# EasyEDA Pro project ProPrj_MiniFoc_AT32F435.epro, schematic 功率板
Create Date: 2023-12-07; Page Name: 电源和功率层; Project Name: Mini_ODrive_AT32F435 FOC驱动器; Schematic Name: Schematic2; Update Date: 2024-02-11; Company: 嘉立创EDA; Page Size: A4; Version: V1.0
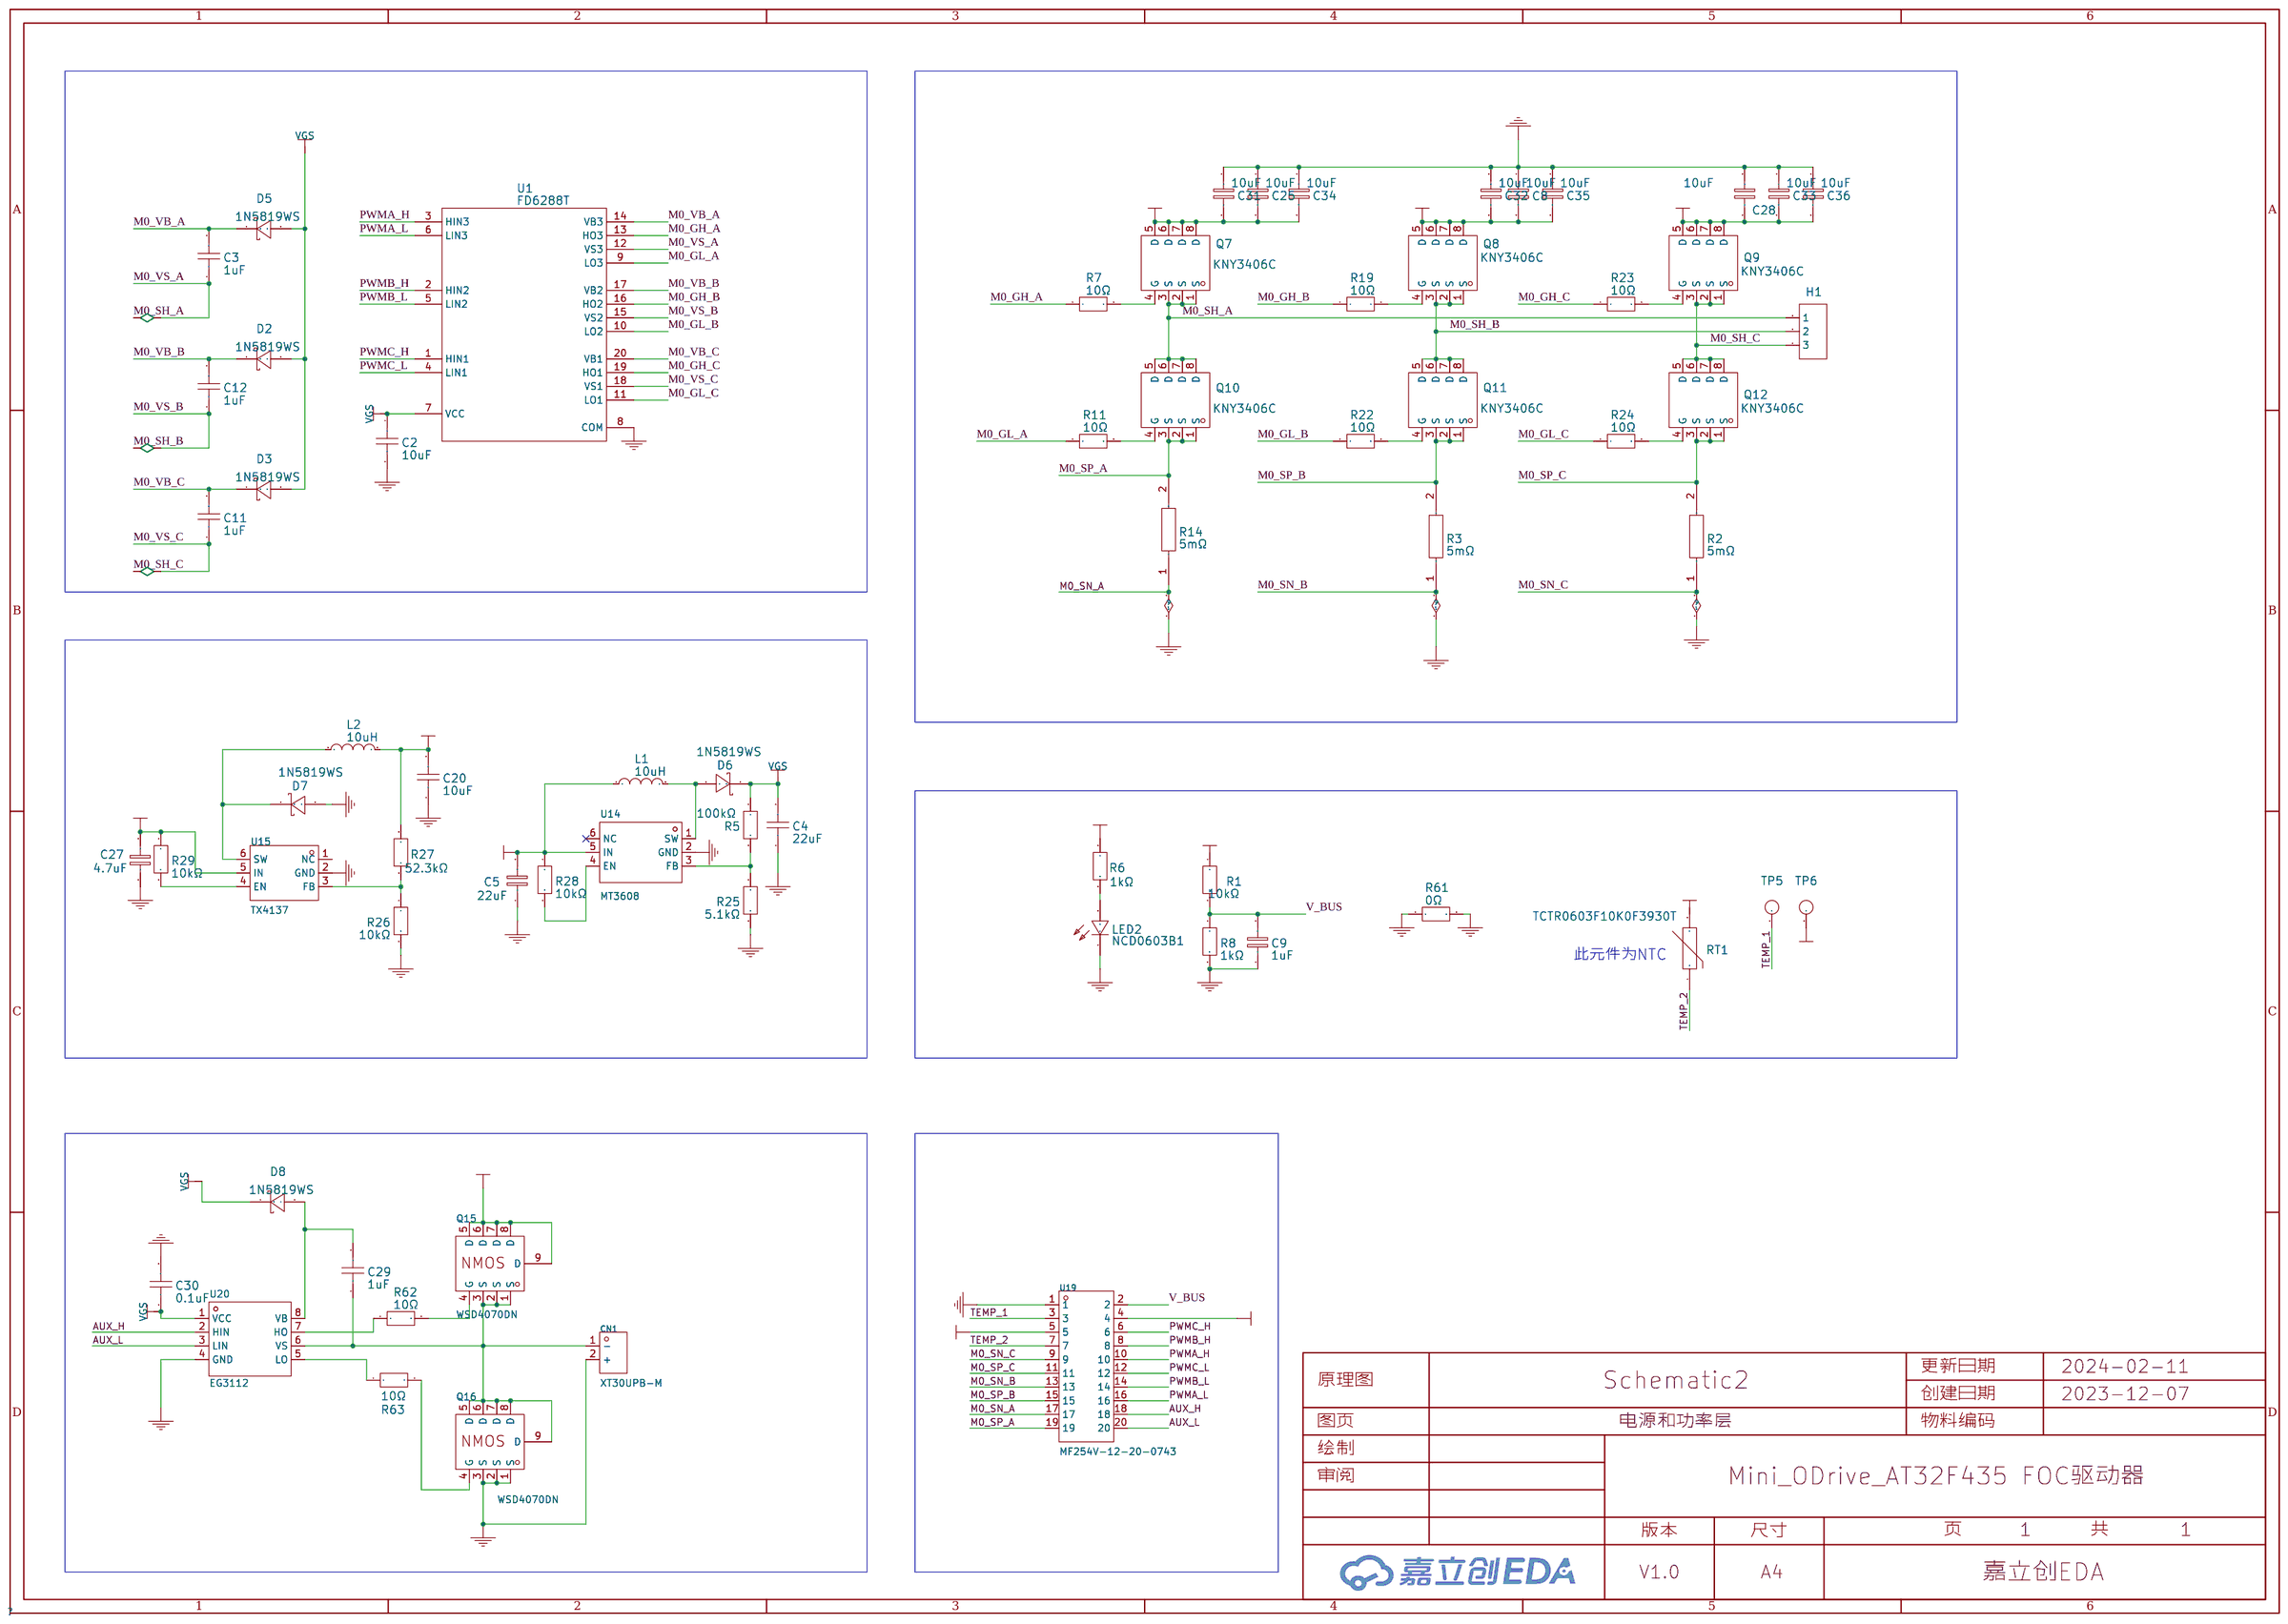
[diagram p1: schematic sheet]

## Parts
C2  10uF  [C0603_SMALL]
C3  1uF  [C0603_SMALL]
C4  22uF  [C1206_SMALL]
C5  22uF  [C1206_SMALL]
C8  10uF  [C1206_SMALL]
C9  1uF  [C0603_SMALL]
C11  1uF  [C0603_SMALL]
C12  1uF  [C0603_SMALL]
C20  10uF  [C1206_SMALL]
C25  10uF  [C1206_SMALL]
C27  4.7uF  [C1206_SMALL]
C28  10uF  [C1206_SMALL]
C29  1uF  [C0603_SMALL]
C30  0.1uF  [C0603_SMALL]
C31  10uF  [C1206_SMALL]
C32  10uF  [C1206_SMALL]
C33  10uF  [C1206_SMALL]
C34  10uF  [C1206_SMALL]
C35  10uF  [C1206_SMALL]
C36  10uF  [C1206_SMALL]
CN1  XT30UPB-M  [CONN-TH_XT30UPB-M]
D2  1N5819WS  [SOD-323_L1.8-W1.3-LS2.5-RD]
D3  1N5819WS  [SOD-323_L1.8-W1.3-LS2.5-RD]
D5  1N5819WS  [SOD-323_L1.8-W1.3-LS2.5-RD]
D6  1N5819WS  [SOD-323_L1.8-W1.3-LS2.5-RD]
D7  1N5819WS  [SOD-323_L1.8-W1.3-LS2.5-RD]
D8  1N5819WS  [SOD-323_L1.8-W1.3-LS2.5-RD]
H1  MR30-M  [MR30-M]
L1  10uH  [IND-SMD_L2.5-W2.0]
L2  10uH  [IND-SMD_L2.5-W2.0]
LED2  NCD0603B1  [LED0603_RED_SMALL]
Q7  KNY3406C  [PDFNWB-8L_L6.0-W5.0-P1.27-BL-EP_CON]
Q8  KNY3406C  [PDFNWB-8L_L6.0-W5.0-P1.27-BL-EP_CON]
Q9  KNY3406C  [PDFNWB-8L_L6.0-W5.0-P1.27-BL-EP_CON]
Q10  KNY3406C  [PDFNWB-8L_L6.0-W5.0-P1.27-BL-EP_CON]
Q11  KNY3406C  [PDFNWB-8L_L6.0-W5.0-P1.27-BL-EP_CON]
Q12  KNY3406C  [PDFNWB-8L_L6.0-W5.0-P1.27-BL-EP_CON]
Q15  WSD4070DN  [PDFN3333-8_L3.1-W3.2-P0.65-LS3.4-BL]
Q16  WSD4070DN  [PDFN3333-8_L3.1-W3.2-P0.65-LS3.4-BL]
R1  10kΩ  [R0603_SMALL]
R2  5mΩ  [R2512]
R3  5mΩ  [R2512]
R5  100kΩ  [R0603_SMALL]
R6  1kΩ  [R0603_SMALL]
R7  10Ω  [R0603_SMALL]
R8  1kΩ  [R0603_SMALL]
R11  10Ω  [R0603_SMALL]
R14  5mΩ  [R2512]
R19  10Ω  [R0603_SMALL]
R22  10Ω  [R0603_SMALL]
R23  10Ω  [R0603_SMALL]
R24  10Ω  [R0603_SMALL]
R25  5.1kΩ  [R0603_SMALL]
R26  10kΩ  [R0603_SMALL]
R27  52.3kΩ  [R0603_SMALL]
R28  10kΩ  [R0603_SMALL]
R29  10kΩ  [R0603_SMALL]
R61  0Ω  [R0603_SMALL]
R62  10Ω  [R0603_SMALL]
R63  10Ω  [R0603_SMALL]
RT1  TCTR0603F10K0F3930T  [R0603_SMALL]
TP5  Testpoint 1.6mm  [TESTPOINT 1.6MM]  (no BOM)
TP6  Testpoint 1.6mm  [TESTPOINT 1.6MM]  (no BOM)
U1  FD6288T  [TSSOP-20_L6.5-W4.4-P0.65-LS6.4-BL]
U14  MT3608  [SOT-23-6_L2.9-W1.6-P0.95-LS2.8-BR]
U15  TX4137  [SOT-23-6_L2.9-W1.6-P0.95-LS2.8-BL]
U19  MF254V-12-20-0743  [HDR-TH_20P-P2.54-V-F-R2-C10-S2.54-3]
U20  EG3112  [SOIC-8_L4.9-W3.9-P1.27-LS6.0-BL]

## Library data of the parts
C2 = GRM188R6YA106MA73D: 容值:10uF;精度:±20%;额定电压:35V;材质(温度系数):-;; LCSC Part Name: 10uF ±20% 35V; Supplier Part: C194427; Manufacturer: muRata(村田); Supplier Footprint: 0603; JLCPCB Part Class: Extended Part; Datasheet: https://atta.szlcsc.com/upload/public/pdf/source/20210128/C194427_FCA3640823207DDB58700A82F1A19B5F.pdf; Supplier: LCSC; Tolerance: ±20%; Voltage Rated: 35V; Check: true
C3 C9 C11 C12 C29 C30 = CC0603KRX5R8BB105: 容值:1uF;精度:±10%;额定电压:25V;材质(温度系数):X5R;; LCSC Part Name: 1uF ±10% 25V; Supplier Part: C14664; Manufacturer: YAGEO(国巨); Supplier Footprint: 0603; JLCPCB Part Class: Extended Part; Datasheet: https://atta.szlcsc.com/upload/public/pdf/source/20160606/1465200209684.pdf; Supplier: LCSC; Tolerance: ±10%; Voltage Rated: 25V; Temperature Coefficient: X5R; Check: true
C4 C20 = C1206B476M016T: 容值:47uF;精度:±20%;额定电压:16V;材质(温度系数):-;; LCSC Part Name: 47uF ±20% 16V; Supplier Part: C607993; Manufacturer: IHHEC(禾伸堂); Supplier Footprint: 1206; JLCPCB Part Class: Extended Part; Datasheet: https://atta.szlcsc.com/upload/public/pdf/source/20190313/C374174_331C86E4A68CC9C732DA87186AAF7F8A.pdf; Supplier: LCSC; Tolerance: ±20%; Voltage Rated: 16V; Check: true
C5 C27 = CC1206KKX7R9BB475: 容值:4.7uF;精度:±10%;额定电压:50V;材质(温度系数):X7R;; LCSC Part Name: 4.7uF ±10% 50V; Supplier Part: C132170; Manufacturer: YAGEO(国巨); Supplier Footprint: 1206; JLCPCB Part Class: Extended Part; Datasheet: https://atta.szlcsc.com/upload/public/pdf/source/20170925/C132170_1506321669570990451.pdf; Supplier: LCSC; Tolerance: ±10%; Voltage Rated: 50V; Temperature Coefficient: X7R; Check: true
C8 C25 C28 C31-C36 = C1206X7R106K500NT: 容值:10uF;精度:±10%;额定电压:50V;材质(温度系数):-;; LCSC Part Name: 10uF ±10% 50V; Supplier Part: C729470; Manufacturer: SANYEAR(叁叶源); Supplier Footprint: 1206; JLCPCB Part Class: Extended Part; Datasheet: https://atta.szlcsc.com/upload/public/pdf/source/20200102/C475251_1E30ECAC0E8AE7254982658A02A2D78C.pdf; Supplier: LCSC; Tolerance: ±10%; Voltage Rated: 50V; Check: true
CN1 = XT30UPB-M: 类别:-;类型1:-;; LCSC Part Name: AMASS(艾迈斯)板载立式 航模锂电池控制器连接器插头 公头XT30UPB-M; Supplier Part: C428721; Manufacturer: AMASS(艾迈斯); JLCPCB Part Class: Extended Part; Datasheet: https://atta.szlcsc.com/upload/public/pdf/source/20230412/7B5DFEF57C9EA5273853390C734B3AC5.pdf; Supplier: LCSC; Brand: 艾迈斯; Type: 航模插头; Colour: 黄色; RatedVoltage: DC 500V; InterfaceType: 公头; MetalMaterial: 镀金; InsulationMaterial: PA; RatedCurrent: 15A; contact resistance: 0.65mΩ
D2 D3 D5-D8 = 1N5819WS_C191023: 直流反向耐压(Vr):40V;平均整流电流(Io):1A;正向压降(Vf):600mV@1A;; LCSC Part Name: 40V 1A 600mV@1A; Supplier Part: C191023; Manufacturer: Hottech(合科泰); Supplier Footprint: SOD-323; JLCPCB Part Class: Basic Part; Datasheet: https://atta.szlcsc.com/upload/public/pdf/source/20220428/3CB86FD8D28D653594B4E35F9D5AEFD9.pdf; Supplier: LCSC; Reverse Voltage (Vr): 40V; Average Rectified Current (Io): 1A; Forward Voltage (Vf@If): 600mV@1A
H1 = MR30-M: Supplier Part: C146690; Supplier: LCSC; Check: true
L1 L2 = SWPA252012S4R7MT: 电感值:4.7uH;精度:±20%;额定电流:840mA;直流电阻(DCR):377mΩ;; LCSC Part Name: 4.7uH ±20% 840mA 377mΩ; Supplier Part: C87640; Manufacturer: Sunlord(顺络); Supplier Footprint: SMD; JLCPCB Part Class: Extended Part; Datasheet: https://atta.szlcsc.com/upload/public/pdf/source/20210916/AC798BA7E846B7D0B6818F45CD84DB0B.pdf; Supplier: LCSC; Tolerance: ±20%; Rated Current: 840mA; DC Resistance (DCR): 377mΩ
LED2 = NCD0603B1: 发光颜色:蓝灯;; LCSC Part Name: 蓝灯; Supplier Part: C84266; Manufacturer: 国星光电; Supplier Footprint: 0603; JLCPCB Part Class: Extended Part; Datasheet: https://atta.szlcsc.com/upload/public/pdf/source/20200820/C84266_6A3CDBEFA72C6CAD68EDA53474ADAE6C.pdf; Supplier: LCSC; Emitted Color: 蓝灯
Q7-Q12 = CJAC100SN08: Supplier: LCSC; Supplier Part: C504077; Manufacturer: CJ; JLCPCB Part Class: Extended Part; Check: true
Q15 Q16 = WSD4070DN: 类型:N沟道;漏源电压(Vdss):40V;连续漏极电流(Id):68A;功率(Pd):3.1W;导通电阻(RDS(on)@Vgs,Id):4.5mΩ@10V,7A;阈值电压(Vgs(th)@Id):1.9V@250uA;; LCSC Part Name: N沟道 耐压:40V 电流:68A; Supplier Part: C719095; Manufacturer: WINSOK(微硕); Supplier Footprint: PDFN3333-8; JLCPCB Part Class: Extended Part; Datasheet: https://atta.szlcsc.com/upload/public/pdf/source/20200812/C719095_C62CD761C2D97EC4C1BD580B00C6E003.pdf; Supplier: LCSC; Type: N沟道; Drain Source Voltage (Vdss): 40V; Continuous Drain Current (Id): 68A; Power Dissipation (Pd): 3.1W; Drain Source On Resistance (RDS(on)@Vgs,Id): 4.5mΩ@10V,7A; Gate Threshold Voltage (Vgs(th)@Id): 1.9V@250uA; Total Gate Charge (Qg@Vgs): 28nC@10V; Input Capacitance (Ciss@Vds): 2.82nF@20V; Reverse Transfer Capacitance (Crss@Vds): 150pF@20V; Operating Temperature: -55℃~+150℃@(Tj)
R1 R25 R26 R28 R29 = CR0603JA0103G: 电阻类型:厚膜电阻;阻值:10kΩ;精度:±5%;功率:100mW;温度系数:±200ppm/℃;最大工作电压:50V;工作温度范围:-55℃~+125℃;; LCSC Part Name: 10kΩ ±5% 100mW; Supplier Part: C101254; Manufacturer: LIZ(丽智电子); Supplier Footprint: 0603; JLCPCB Part Class: Extended Part; Datasheet: https://atta.szlcsc.com/upload/public/pdf/source/20170408/1491631441449.pdf; Supplier: LCSC; Type: 厚膜电阻; Tolerance: ±5%; Power(Watts): 100mW; Temperature Coefficient: ±200ppm/℃; Overload Voltage (Max): 50V; Operating Temperature Range: -55℃~+125℃; Check: true
R2 R3 R14 = FMF25FPHR005-LHL: 阻值:5mΩ;精度:±1%;功率:1W;温度系数:±70ppm/℃;; LCSC Part Name: 5mΩ ±1% 1W; Supplier Part: C105361; Manufacturer: PSA(信昌电陶); Supplier Footprint: 2512; JLCPCB Part Class: Extended Part; Datasheet: https://atta.szlcsc.com/upload/public/pdf/source/20170410/1491788444204.pdf; Supplier: LCSC; Tolerance: ±1%; Power(Watts): 1W; Temperature Coefficient: ±70ppm/℃
R5 R27 = RMC 0603 52K3 F N: 阻值:52.3kΩ;精度:±1%;功率:100mW;; LCSC Part Name: 52.3kΩ ±1% 100mW; Supplier Part: C325624; Manufacturer: Tyohm(幸亚电阻); Supplier Footprint: 0603; JLCPCB Part Class: Extended Part; Datasheet: https://atta.szlcsc.com/upload/public/pdf/source/20190115/C325624_C83DA14843559B976A7F252575C1556F.pdf; Supplier: LCSC; Tolerance: ±1%; Power(Watts): 100mW; Check: true
R6 R8 = SCR0603J1K: 阻值:1kΩ;精度:±5%;; LCSC Part Name: 1kΩ ±5%; Supplier Part: C3017736; Manufacturer: VO(翔胜); Supplier Footprint: 0603; JLCPCB Part Class: Extended Part; Datasheet: https://atta.szlcsc.com/upload/public/pdf/source/20220513/247AF9639BA21CF93567DC289CCC6A22.pdf; Supplier: LCSC; Tolerance: ±5%; Check: true
R7 R11 R19 R22-R24 R62 R63 = CR0603J2R20P05Z: 阻值:2.2Ω;精度:±5%;功率:100mW;温度系数:±400ppm/℃;; LCSC Part Name: 2.2Ω ±5% 100mW; Supplier Part: C881125; Manufacturer: EVER OHMS(天二科技); Supplier Footprint: 0603; JLCPCB Part Class: Extended Part; Datasheet: https://atta.szlcsc.com/upload/public/pdf/source/20201014/C881429_ABC29D63C8D6A11EB63D87348B25AA7B.pdf; Supplier: LCSC; Tolerance: ±5%; Power(Watts): 100mW; Temperature Coefficient: ±400ppm/℃; Check: true
R61 = CR0603F0R00P05Z: 阻值:0Ω;精度:±1%;功率:100mW;; LCSC Part Name: 0Ω ±1% 100mW; Supplier Part: C881308; Manufacturer: EVER OHMS(天二科技); Supplier Footprint: 0603; JLCPCB Part Class: Extended Part; Datasheet: https://atta.szlcsc.com/upload/public/pdf/source/20201014/C881429_ABC29D63C8D6A11EB63D87348B25AA7B.pdf; Supplier: LCSC; Tolerance: ±1%; Power(Watts): 100mW; Type: 厚膜电阻; Overload Voltage (Max): 75V; Operating Temperature Range: -55℃~+155℃; Check: true
RT1 = TCTR0603F10K0F3930T: 阻值(25℃):10kΩ;电阻精度:±1%;B值精度:±1%;B值(25℃/50℃):3930K;功率:120mW;最大稳态电流(25℃):-;B值(25℃/75℃):-;B值(25℃/85℃):-;B值(25℃/100℃):-;工作温度:-40℃~+125℃;; LCSC Part Name: 10kΩ 电阻精度:±1% 3930K; Supplier Part: C525383; Manufacturer: RESI(开步睿思）; Supplier Footprint: 0603; JLCPCB Part Class: Extended Part; Datasheet: https://atta.szlcsc.com/upload/public/pdf/source/20200506/C525364_82DA399420FD8342B6C8F2E2EC87328D.pdf; Supplier: LCSC; Resistance @ 25℃: 10kΩ; Resistance Tolerance: ±1%; B Constant Tolerance: ±1%; B Constant (25℃/50℃): 3930K; Power: 120mW; Operating Temperature: -40℃~+125℃; Check: true
TP5 TP6 = Testpoint 1.6mm: Check: true
U1 = FD6288T: 三个独立的半桥栅极驱动集成电路芯片; Supplier Part: C97683; Manufacturer: Fortior Tech(峰岹); Supplier Footprint: TSSOP-20; JLCPCB Part Class: Extended Part; Datasheet: https://atta.szlcsc.com/upload/public/pdf/source/20180912/C97683_ECE58C9DF7F061C95E95DF4276B152DC.pdf; Supplier: LCSC
U14 = MT3608: 功能类型:升压型;同步整流:-;输出通道数:1;拓扑结构:升压式;输入电压:2V~24V;输出电压:28V;输出电流(最大值):-;开关频率:1.2MHz;; LCSC Part Name: 升压型 2V~24V 1.2MHz; Supplier Part: C84817; Manufacturer: 西安航天民芯; Supplier Footprint: SOT-23-6; JLCPCB Part Class: 扩展库; Datasheet: https://atta.szlcsc.com/upload/public/pdf/source/20161110/1478743351706.pdf; Supplier: LCSC; Function: 升压型; Number of Outputs: 1; Topology: 升压式; Input Voltage: 2V~24V; Output Voltage: 28V; Switching Frequency: 1.2MHz
U15 = TX4137: 功能类型:降压型;输出类型:-;输入电压:5.5V~60V;输出电压:500mV~30V;输出电流(最大值):600mA;; LCSC Part Name: 降压型 输入5.5V~60V 输出500mV~30V 600mA; Supplier Part: C691124; Manufacturer: XDS(芯鼎盛); Supplier Footprint: SOT-23-6; JLCPCB Part Class: 扩展库; Datasheet: https://atta.szlcsc.com/upload/public/pdf/source/20200622/C691124_183BE09930AFAE82C8AA652A9A755F31.pdf; Supplier: LCSC; Function: 降压型; Number of Outputs: 1; Input Voltage: 5.5V~60V; Output Voltage: 500mV~30V; Output Current (Max): 600mA; Switching Frequency: 1MHz; Quiescent Current (Iq): 800uA; Operating Temperature: -40℃~+125℃@(TA)
U19 = MF254V-12-20-0743: 排数:双排;总孔位数:20P;间距:2.54mm;插孔结构:2x10P;行距:2.54mm;安装类型:直插;圆孔/方孔:圆孔;额定电流:3A;额定电压:60V;插孔方向:顶部;塑高:3mm;工作温度范围:-40℃~+105℃;; LCSC Part Name: 间距:2.54mm 2x10P 直插; Supplier Part: C2895848; Manufacturer: XFCN(兴飞); Supplier Footprint: 插件,P=2.54mm; JLCPCB Part Class: 扩展库; Datasheet: https://atta.szlcsc.com/upload/public/pdf/source/20210915/C2895848_C1D8871E01F6B54B2EDCE456E4958033.pdf; Supplier: LCSC; Number of Rows: 双排; Number of Holes: 20P; Pitch: 2.54mm; Holes Structure: 2x10P; Row Spacing: 2.54mm; Mounting Type: 直插; Circular Hole / Square Hole: 圆孔; Current Rating (Max): 3A; Voltage Rating (Max): 60V; Holes Direction: 顶部; Insulation Height: 3mm; Operating Temperature Range: -40℃~+105℃
U20 = EG3112: 600V，IO+1A/-1.5A，大功率MOS管、IGBT管栅极驱动IC; Supplier Part: C111908; Manufacturer: EG(屹晶微); Supplier Footprint: SOIC-8; JLCPCB Part Class: Extended Part; Datasheet: https://atta.szlcsc.com/upload/public/pdf/source/20230725/3992D5BD05E91E0CBB5D3EE72F4B3B26.pdf; Supplier: LCSC

## Nets
5V: C5.2 C20.2 L1.1 L2.2 R6.1 R27.1 R28.1 U14.5(IN) U19.4
GND: C2.2 C4.1 C5.1 C9.1 C20.1 C27.1 C30.2 D7.2(A) LED2.1(K) R8.2 R25.2 R26.2 R61.2 U1.8(COM) U14.2(GND) U15.2(GND) U19.1 U20.4(GND)
PGND: C8.1 C25.1 C28.1 C31.1 C32.1 C33.1 C34.1 C35.1 C36.1 CN1.2(+) Q16.1(S) Q16.2(S) Q16.3(S) R2.1 R3.1 R14.1 R61.1 U19.9 U19.13 U19.17
VCC: RT1.2 TP6.1 U19.5
AUX_H: U19.18 U20.2(HIN)
AUX_L: U19.20 U20.3(LIN)
DCBUS: C8.2 C25.2 C27.2 C28.2 C31.2 C32.2 C33.2 C34.2 C35.2 C36.2 Q7.5(D) Q7.6(D) Q7.7(D) Q7.8(D) Q8.5(D) Q8.6(D) Q8.7(D) Q8.8(D) Q9.5(D) Q9.6(D) Q9.7(D) Q9.8(D) Q15.5(D) Q15.6(D) Q15.7(D) Q15.8(D) Q15.9(D) R1.1 R29.1 U15.5(IN)
M0_GH_A: R7.1 U1.13(HO3)
M0_GH_B: R19.1 U1.16(HO2)
M0_GH_C: R23.1 U1.19(HO1)
M0_GL_A: R11.1 U1.9(LO3)
M0_GL_B: R22.1 U1.10(LO2)
M0_GL_C: R24.1 U1.11(LO1)
M0_SH_A: C3.1 H1.3(1) Q7.1(S) Q7.2(S) Q7.3(S) Q10.5(D) Q10.6(D) Q10.7(D) Q10.8(D) U1.12(VS3)
M0_SH_B: C12.1 H1.2 Q8.1(S) Q8.2(S) Q8.3(S) Q11.5(D) Q11.6(D) Q11.7(D) Q11.8(D) U1.15(VS2)
M0_SH_C: C11.1 H1.1(3) Q9.1(S) Q9.2(S) Q9.3(S) Q12.5(D) Q12.6(D) Q12.7(D) Q12.8(D) U1.18(VS1)
M0_SP_A: Q10.1(S) Q10.2(S) Q10.3(S) R14.2 U19.19
M0_SP_B: Q11.1(S) Q11.2(S) Q11.3(S) R3.2 U19.15
M0_SP_C: Q12.1(S) Q12.2(S) Q12.3(S) R2.2 U19.11
M0_VB_A: C3.2 D5.1(C) U1.14(VB3)
M0_VB_B: C12.2 D2.1(C) U1.17(VB2)
M0_VB_C: C11.2 D3.1(C) U1.20(VB1)
PWMA_H: U1.3(HIN3) U19.10
PWMA_L: U1.6(LIN3) U19.16
PWMB_H: U1.2(HIN2) U19.8
PWMB_L: U1.5(LIN2) U19.14
PWMC_H: U1.1(HIN1) U19.6
PWMC_L: U1.4(LIN1) U19.12
TEMP_1: TP5.1 U19.3
TEMP_2: RT1.1 U19.7
V_BUS: C9.2 R1.2 R8.1 U19.2
VGS: C2.1 C4.2 C30.1 D2.2(A) D3.2(A) D5.2(A) D6.1(C) D8.1(C) R5.1 U1.7(VCC) U20.1(VCC)
$1N2378: Q12.4(G) R24.2
$1N2381: Q11.4(G) R22.2
$1N2384: Q7.4(G) R7.2
$1N2446: Q10.4(G) R11.2
$1N2450: Q8.4(G) R19.2
$1N2453: Q9.4(G) R23.2
$1N2498: R29.2 U15.4(EN)
$1N2500: D7.1(C) L2.1 U15.6(SW)
$1N2502: R26.1 R27.2 U15.3(FB)
$1N2507: R28.2 U14.4(EN)
$1N2509: R5.2 R25.1 U14.3(FB)
$1N2515: D6.2(A) L1.2 U14.1(SW)
$1N4147: Q15.4(G) R62.2
$1N4272: C29.2 D8.2(A) U20.8(VB)
$1N4301: R62.1 U20.7(HO)
$1N4305: R63.1 U20.5(LO)
$1N4309: Q16.4(G) R63.2
$1N14196: LED2.2(A) R6.2
Net-(C29-1): C29.1 CN1.1(-) Q15.1(S) Q15.2(S) Q15.3(S) Q16.5(D) Q16.6(D) Q16.7(D) Q16.8(D) Q16.9(D) U20.6(VS)

Not connected (* = marked no-connect by the designer): U14 6(NC)*; U15 1(NC)

## Notes on the sheet
- 此元件为NTC
